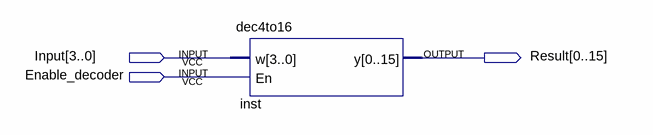
[diagram p0: schematic sheet]
// Quartus schematic dec4to16BDF.bdf as structural Verilog: 1 symbols, 3 pins
module dec4to16BDF (
  input  [3:0] Input,
  input  Enable_decoder,
  output [0:15] Result
);

  dec4to16 inst (.w(Input), .En(Enable_decoder), .y(Result));
endmodule
